# EAGLE design PSUBoard (EAGLE 7.6.0)
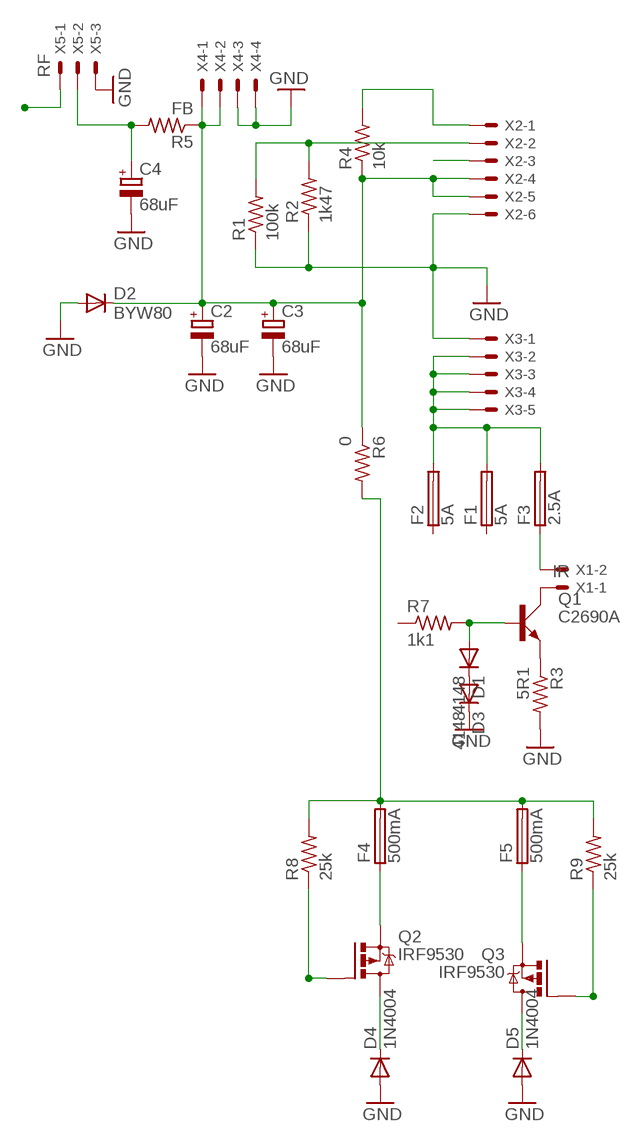
[diagram p0: schematic, sheet 1]

## Parts
C2  68uF  CPOL-EUE3.5-10  [E3,5-10]
C3  68uF  CPOL-EUE3.5-10  [E3,5-10]
C4  68uF  CPOL-EUE3.5-10  [E3,5-10]
D1  4148  1N4148DO35-7  [DO35-7]
D2  BYW80  [TO220ACS]
D3  4148  1N4148DO35-7  [DO35-7]
D4  1N4004  [DO41-10]
D5  1N4004  [DO41-10]
F1  5A  TR5  [TR5]
F2  5A  TR5  [TR5]
F3  2.5A  TR5  [TR5]
F4  500mA  TR5  [TR5]
F5  500mA  TR5  [TR5]
Q1  C2690A  BD139  [TO126AV]
Q2  IRF9530  [TO220BV]
Q3  IRF9530  [TO220BV]
R1  100k  R-US_0309/12  [0309/12]
R2  1k47  R-US_0617/22  [0617/22]
R3  5R1  R-US_0309/10  [0309/10]
R4  10k  R-US_0309/12  [0309/12]
R5  FB  R-US_0309/12  [0309/12]
R6  0  R-US_0309/12  [0309/12]
R7  1k1  R-US_0309/10  [0309/10]
R8  25k  R-US_0309/10  [0309/10]
R9  25k  R-US_0309/10  [0309/10]
X1  IR  22-23-2021  [22-23-2021]
X2  22-23-2061  [22-23-2061]
X3  22-23-2051  [22-23-2051]
X4  22-23-2041  [22-23-2041]
X5  RF  22-23-2031  [22-23-2031]

## Nets
GND: C2.- C3.- C4.- D2.A D3.C D4.A D5.A R1.1 R2.1 R3.2 X2.6 X3.1 X4.3 X4.4 X5.3
N$1: C4.+ R5.2 X5.2
N$2: F1.2 F2.2 F3.2 X3.2 X3.3 X3.4 X3.5
N$3: X5.1
N$5: C2.+ C3.+ D2.C R4.1 R5.1 R6.1 X2.4 X2.5 X4.1 X4.2
N$7: R4.2 X2.1
N$8: R1.2 R2.2 X2.2
N$9: X2.3
N$11: Q1.C X1.1
N$12: F3.1 X1.2
N$13: Q1.E R3.1
N$14: D1.C D3.A
N$15: D1.A Q1.B R7.2
N$18: F4.2 F5.2 R6.2 R8.2 R9.2
N$19: F4.1 Q2.S
N$20: F5.1 Q3.S
N$21: D4.C Q2.D
N$22: D5.C Q3.D
N$23: Q2.G R8.1
N$24: Q3.G R9.1
Unconnected: F1.1 F2.1 R7.1

## Library data of the parts
C2-C4 = resistor:CPOL-EU: POLARIZED CAPACITOR, European symbol
D1 D3 = diode:1N4148: DIODE high speed (Philips)
D2 = diode:BYW80: DIODE high-efficiency fast recovery rectifier (ST)
D4 D5 = diode:1N4004: DIODE general purpose rectifier, 1 A
F1-F5 = fuse:TR5: FUSE Wickmann; OC_FARNELL: unknown; OC_NEWARK: unknown
Q1 = transistor-power:BD139: NPN TRANSISTOR
Q2 Q3 = transistor-power:IRF9530: P-CHANNEL HEXFET POWER-MOS-FET Source: http://www.irf.com/product-info/datasheets/data/irf9530.pdf
R1-R9 = resistor:R-US_: RESISTOR, American symbol
X1 = con-molex:22-23-2021: .100" (2.54mm) Center Header - 2 Pin; MF: MOLEX; MPN: 22-23-2021; OC_FARNELL: 1462926; OC_NEWARK: 25C3832
X2 = con-molex:22-23-2061: .100" (2.54mm) Center Header - 6 Pin; MF: MOLEX; MPN: 22-23-2061; OC_FARNELL: 1462922; OC_NEWARK: 27C1933
X3 = con-molex:22-23-2051: .100" (2.54mm) Center Header - 5 Pin; MF: MOLEX; MPN: 22-23-2051; OC_FARNELL: 1462952; OC_NEWARK: 38C9178
X4 = con-molex:22-23-2041: .100" (2.54mm) Center Header - 4 Pin; MF: MOLEX; MPN: 22-23-2041; OC_FARNELL: 1462920; OC_NEWARK: 38C0355
X5 = con-molex:22-23-2031: .100" (2.54mm) Center Header - 3 Pin; MF: MOLEX; MPN: 22-23-2031; OC_FARNELL: 1462950; OC_NEWARK: 30C0862

## Board
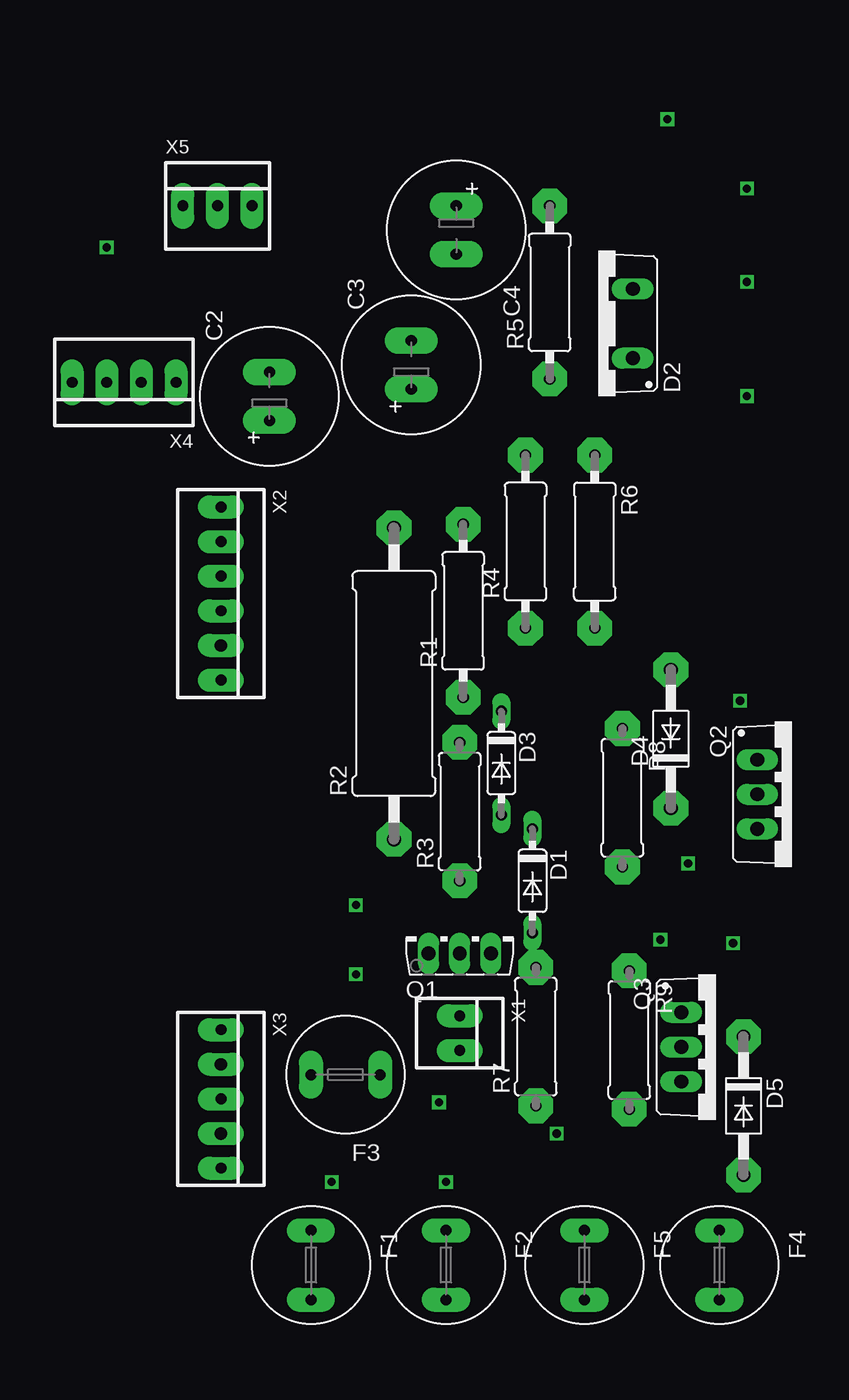
[diagram p1: board, top side]
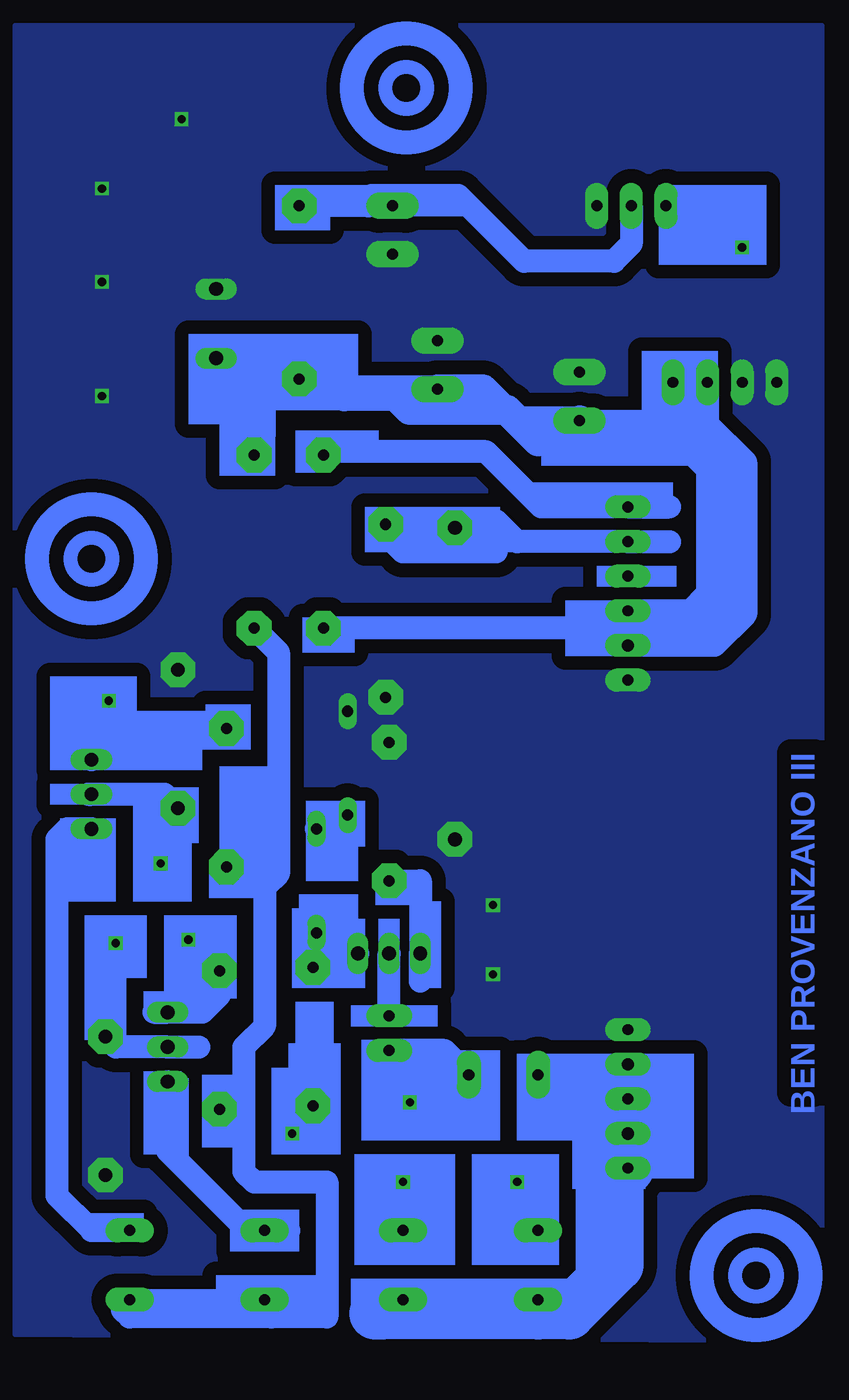
[diagram p2: board, bottom side, seen from below]

No outline drawn. Coordinates in mm, seen from the top.
Copper layers (1*16): Top 0.035mm / dielectric 1.5mm / Bottom 0.035mm
Design rules "default": minimum track width 10mil, minimum drill 24mil, track to track 8mil, track to pad 8mil, pad to pad 8mil, via to via 8mil, smd to smd 8mil, copper to edge 40mil, drill to drill 8mil, minimum pad ring 10mil, minimum via ring 8mil, stop-mask expansion 4mil, vias tented up to drill 0mil, thermal gap 10mil

### Footprints (pad centres in the part's own frame; a part is rotated, then mirrored left to right if it is on the bottom)
E3,5-10 = drill 0.813 pad 1.93 long: + -1.778,0; - 1.778,0
DO35-7 = drill 0.813 long: A 3.81,0; C -3.81,0
TO220ACS = drill 1.016 long: A 2.54,-2.54; C -2.54,-2.54
DO41-10 = drill 1 pad 2.54 octagon: A 5.08,0; C -5.08,0
TR5 = drill 0.813 pad 1.778 long: 1 -2.54,0; 2 2.54,0
TO126AV = drill 1.016 long: B 2.286,-1.27; C 0,-1.27; E -2.286,-1.27
TO220BV = drill 1.016 long: D 0,-2.54; G -2.54,-2.54; S 2.54,-2.54
0309/12 = drill 0.813 pad 2.54 octagon: 1 -6.35,0; 2 6.35,0
0617/22 = drill 1.016 pad 2.54 octagon: 1 -11.43,0; 2 11.43,0
0309/10 = drill 0.813 pad 2.54 octagon: 1 -5.08,0; 2 5.08,0
22-23-2021 = drill 0.8 pad 1.676 long: 1 -1.27,0; 2 1.27,0
22-23-2061 = drill 0.8 pad 1.676 long: 1 -6.35,0; 2 -3.81,0; 3 -1.27,0; 4 1.27,0; 6 6.35,0 | drill 0.9 pad 1.676 long: 5 3.81,0
22-23-2051 = drill 0.8 pad 1.676 long: 1 -5.08,0; 3 0,0; 5 5.08,0 | drill 0.9 pad 1.676 long: 2 -2.54,0; 4 2.54,0
22-23-2041 = drill 0.8 pad 1.676 long: 1 -3.81,0; 2 -1.27,0; 3 1.27,0; 4 3.81,0
22-23-2031 = drill 0.8 pad 1.676 long: 1 -2.54,0; 2 0,0; 3 2.54,0

### Placement (x,y rotation side)
C2  29.21,66.29 90 top
C3  39.62,68.58 90 top
C4  42.93,78.49 270 top
D1  48.51,30.73 270 top
D2  53.34,71.63 90 top
D3  46.23,39.37 270 top
D4  58.67,41.15 90 top
D5  64.01,14.22 270 top
F1  32.26,2.54 270 top
F2  42.16,2.54 270 top
F3  34.8,16.51 180 top
F4  62.23,2.54 270 top
F5  52.32,2.54 270 top
Q1  43.18,26.67 0 top
Q2  67.56,37.08 270 top
Q3  61.98,18.54 270 top
R1  43.43,50.55 90 top
R2  38.35,45.21 90 top
R3  43.18,35.81 90 top
R4  48.01,55.63 90 top
R5  49.78,73.91 90 top
R6  53.09,55.63 270 top
R7  48.77,19.3 90 top
R8  55.12,36.83 270 top
R9  55.63,19.05 270 top
X1  43.18,19.56 270 top
X2  25.65,51.82 270 top
X3  25.65,14.73 270 top
X4  18.54,67.31 180 top
X5  25.4,80.26 0 top

### Tracks (layer width: path | path; a pad name or v marks a point on that pad's centre or on a via)
GND  (via drill 0.6)
  other vias: 64.26,66.29 64.26,74.68 35.56,28.96 35.56,23.88 64.26,81.53 58.42,86.61
  pour Bottom (isolate 1.016, no thermals): 11.43,93.47 70.61,93.47 70.61,-2.54 11.43,-3.05
N$1
  Bottom 1.676: X5.2 25.4,77.47 26.67,76.2 33.27,76.2 38.1,81.03 41.66,81.03 | 41.66,81.03 44.45,81.03 44.7,80.26 R5.2 | C4.+ 41.66,81.03
N$2
  Bottom 1.676: X3.2 X3.3 X3.4 | X3.4 X3.5 | F3.2 29.21,16.51 X3.4
  Bottom 1.93: F1.2 32.77,-1.02 32.26,-1.02 | F2.2 43.69,-1.02
  Bottom 3.81: X3.5 26.42,8.89 26.42,2.54 29.97,-1.02 32.26,-1.02 43.69,-1.02 44.2,-1.02
N$4  (via drill 0.6)
  other vias: 17.27,77.22
N$5
  Bottom 1.676: X2.5 X2.4 21.08,50.55 19.81,51.82 19.81,60.96 22.1,63.25 X4.1 | X2.5 26.92,49.28 R4.1 | X4.2 19.81,64.26 17.02,61.47 17.02,50.29 19.3,48.01 X2.5 | 46.48,66.29 R5.1 49.4,69.22 | 49.4,69.22 49.53,69.34 52.07,69.34 | 52.07,69.34 D2.C | 52.32,63.5 52.32,66.8 49.91,69.22 49.4,69.22 | R6.1 52.07,69.34
  Bottom 2.184: 22.1,63.25 21.84,63.5 21.08,63.5 22.1,62.48 27.18,62.48 C2.+ 30.73,62.99 32.26,62.99 34.54,65.28 35.05,65.28 | 35.05,65.28 41.66,65.28 42.67,66.29 46.48,66.29 | C3.+ 36.32,66.8 35.05,65.53 35.05,65.28
N$6  (via drill 0.6)
  other vias: 33.78,8.64
N$7
  Bottom 1.676: 22.61,58.17 X2.1 32,58.17 36.07,62.23 47.75,62.23 R4.2
N$8
  Bottom 1.676: 22.61,55.63 X2.2 33.78,55.63 35.31,57.15 38.1,57.15 38.35,56.9 R2.2 38.35,54.86 | 35.31,54.86 38.35,54.86 | 38.35,54.86 42.16,54.86 43.43,56.13 R1.2
N$10  (via drill 0.6)
  other vias: 42.16,8.64
N$11
  Bottom 1.676: X1.1 Q1.C
N$12
  Bottom 1.676: F3.1 39.12,18.29 X1.2
N$13
  Bottom 1.676: R3.1 40.89,30.73 Q1.E 40.89,23.37
N$14
  Bottom 1.676: D1.C 47.5,35.56 D3.A
N$15
  Bottom 1.676: Q1.B 47.5,27.43 48.77,27.43 49.28,26.92 49.28,24.13 49.02,24.38 R7.2 48.51,24.64 D1.A
N$16  (via drill 0.6)
  other vias: 41.66,14.48
N$17  (via drill 0.6)
  other vias: 50.29,12.19
N$18
  Bottom 1.676: R6.2 51.31,47.5 51.31,31.24 52.2,30.35 | 52.2,30.35 52.32,30.23 52.32,20.07 53.85,18.54 53.85,13.97 | 53.85,13.97 53.85,9.4 53.09,8.64 47.75,8.64 47.75,-1.27 51.82,-1.27 | 51.82,-1.27 62.23,-1.27 62.74,-0.76 62.74,-0.51 F4.2 | F5.2 51.82,-0.51 51.82,-1.27 | R9.2 53.85,13.97 | R8.2 53.72,30.35 52.2,30.35
N$19
  Bottom 1.676: Q2.S 66.8,34.54 67.56,33.78 67.56,7.62 65.02,5.08 F4.1
N$20
  Bottom 1.676: 50.55,5.08 F5.1 53.59,5.08 59.44,10.92 Q3.S
N$21
  Bottom 1.676: D4.C 59.69,37.08 Q2.D 65.28,37.08
N$22
  Bottom 1.676: 57.15,18.54 Q3.D 63.25,18.54 D5.C
N$23
  Bottom 1.676: Q2.G 62.74,41.91 R8.1
N$24
  Bottom 1.676: R9.1 55.63,22.35 56.9,21.08 Q3.G 60.45,21.08
N$25  (via drill 0.6)
  other vias: 63.75,43.94
N$26  (via drill 0.6)
  other vias: 57.91,26.42
N$27  (via drill 0.6)
  other vias: 63.25,26.16
N$28  (via drill 0.6)
  other vias: 59.94,32
(copper drawn outside any net)
  shapes: Bottom area x124, Bottom circle x6

### Text on the board
Bottom: BEN PROVENZANO III